# EAGLE design FDL-2X CTRL (EAGLE 8.3.2)
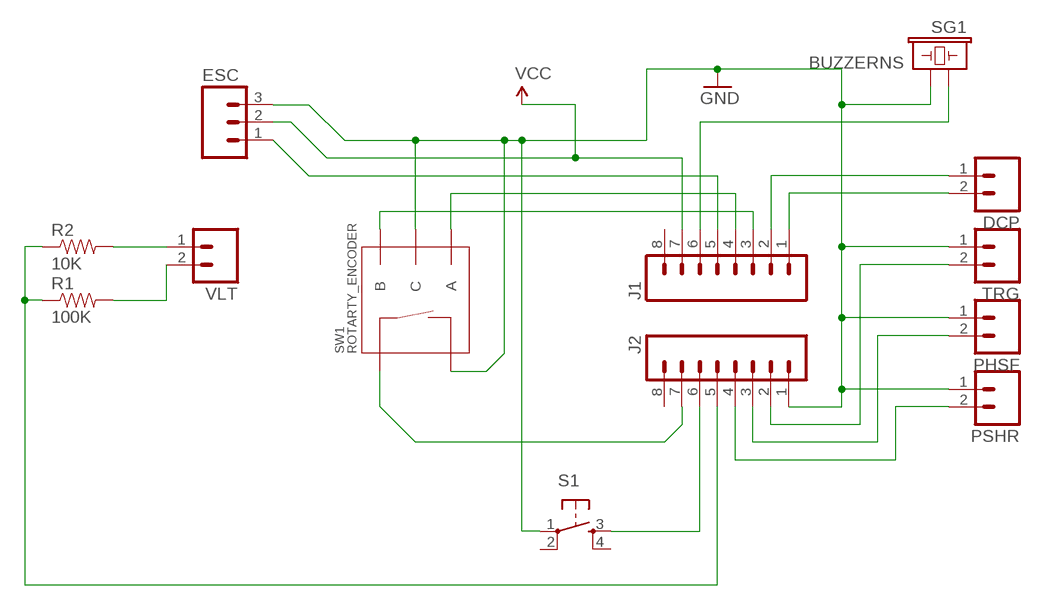
[diagram p0: schematic, sheet 1]

## Parts
DCP  M02PTH  [1X02]
ESC  M03PTH  [1X03]
J1  M08SILK_FEMALE_PTH  [1X08]
J2  M08SILK_FEMALE_PTH  [1X08]
PHSF  M02PTH  [1X02]
PSHR  M02PTH  [1X02]
R1  100K  RESISTORAXIAL-0.3  [AXIAL-0.3]
R2  10K  RESISTORAXIAL-0.3  [AXIAL-0.3]
S1  TAC_SWITCHPTH  [TACTILE-PTH]
SG1  BUZZERNS  [BUZZER-12MM-NS]
SW1  ROTARTY_ENCODER  [ROTARY_ENC_PLAIN]
TRG  M02PTH  [1X02]
VLT  M02PTH  [1X02]

## Nets
GND: ESC.3 J2.1 PHSF.1 PSHR.1 S1.1 SG1.- SW1.C SW1.SW- TRG.1
N$1: ESC.1 J1.5
N$2: J2.6 S1.3
N$3: J2.2 TRG.2
N$4: J2.3 PHSF.2
N$6: J2.7 SW1.SW+
N$7: J2.4 PSHR.2
N$8: J1.4 SW1.A
N$9: J1.3 SW1.B
N$10: DCP.1 J1.2
N$11: R2.P$2 VLT.1
N$12: DCP.2 J1.1
N$13: R1.P$2 VLT.2
N$14: J1.6 SG1.+
N$18: J2.5 R1.P$1 R2.P$1
VCC: ESC.2 J1.7
Unconnected: J1.8 J2.8 S1.2 S1.4

## Library data of the parts
DCP PHSF PSHR TRG VLT = SparkFun-Connectors:M02: Standard 2-pin 0.1" header. Use with - straight break away headers ( PRT-00116) - right angle break away headers (PRT-00553) - swiss pins (PRT-00743) - machine pins (PRT-00117) - female headers (PRT-00115) Molex polarized connector foot print use with: PRT-08233 with associated crimp pins and housings. 2.54_SCREWTERM for use with PRT-10571. 3.5mm Screw Terminal footprints for PRT-08084 5mm Screw Terminal footprints for use with PRT-08432
ESC = SparkFun-Connectors:M03: Header 3 Standard 3-pin 0.1" header. Use with straight break away headers (SKU : PRT-00116), right angle break away headers (PRT-00553), swiss pins (PRT-00743), machine pins (PRT-00117), and female headers (PRT-00115). Molex polarized connector foot print use with SKU : PRT-08232 with associated crimp pins and housings.
J1 J2 = SparkFun-Connectors:M08: Header 8 Standard 8-pin 0.1" header. Use with straight break away headers (SKU : PRT-00116), right angle break away headers (PRT-00553), swiss pins (PRT-00743), machine pins (PRT-00117), and female headers (PRT-00115).; PROD_ID: CONN-08438
R1 R2 = SparkFun-Passives:RESISTOR: Resistor Basic schematic elements and footprints for 0603, 1206, and PTH resistors.
S1 = SparkFun-Retired:TAC_SWITCH: Momentary Switch Button commonly used for reset or general input. Spark Fun Electronics SKU : COM-00097 SMT- SWCH-08247
SG1 = SparkFun-Electromechanical:BUZZER: Buzzer 12mm Spark Fun Electronics SKU : Comp-Buzzer
SW1 = Encoder:ROTARTY_ENCODER: Simple no LED rotary encoder Example: COM-09117

## Board
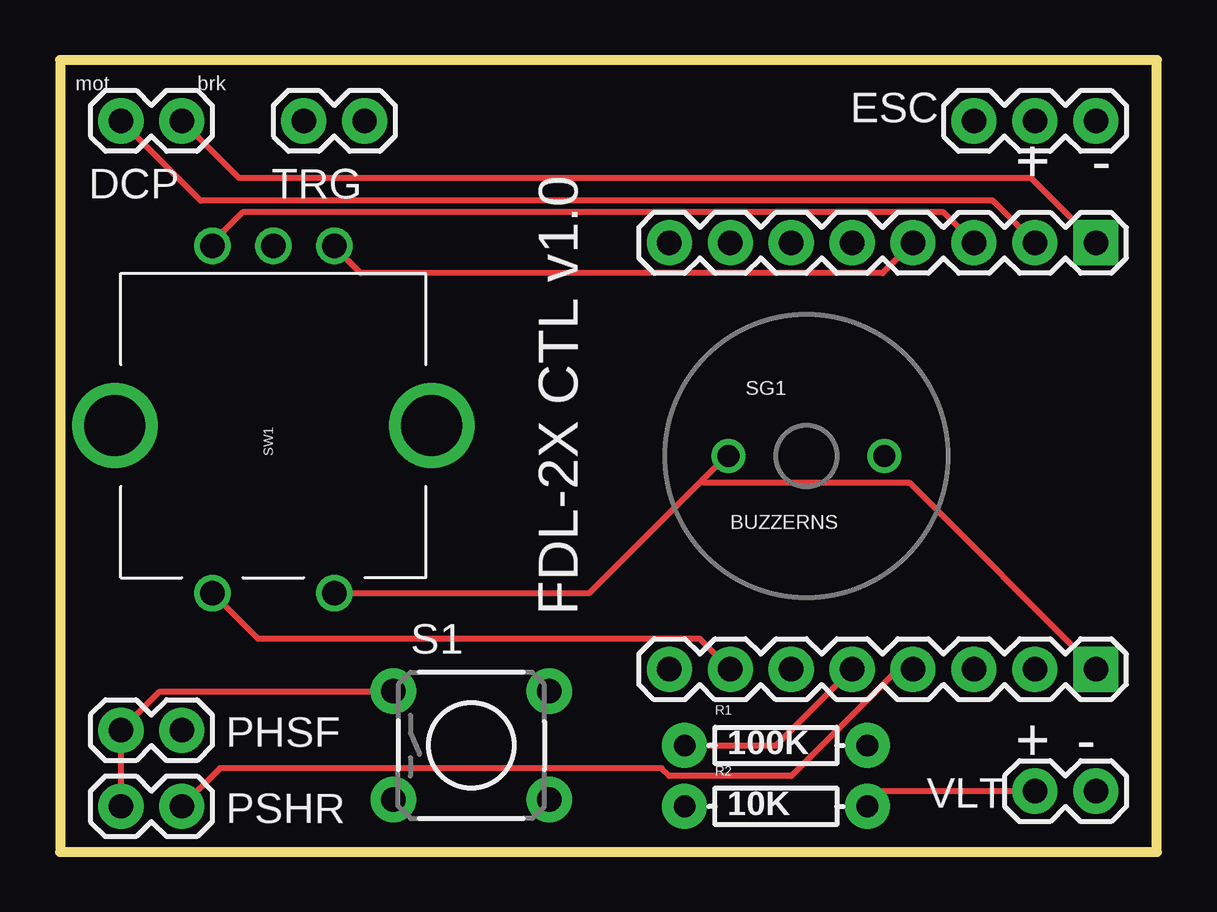
[diagram p1: board, top side]
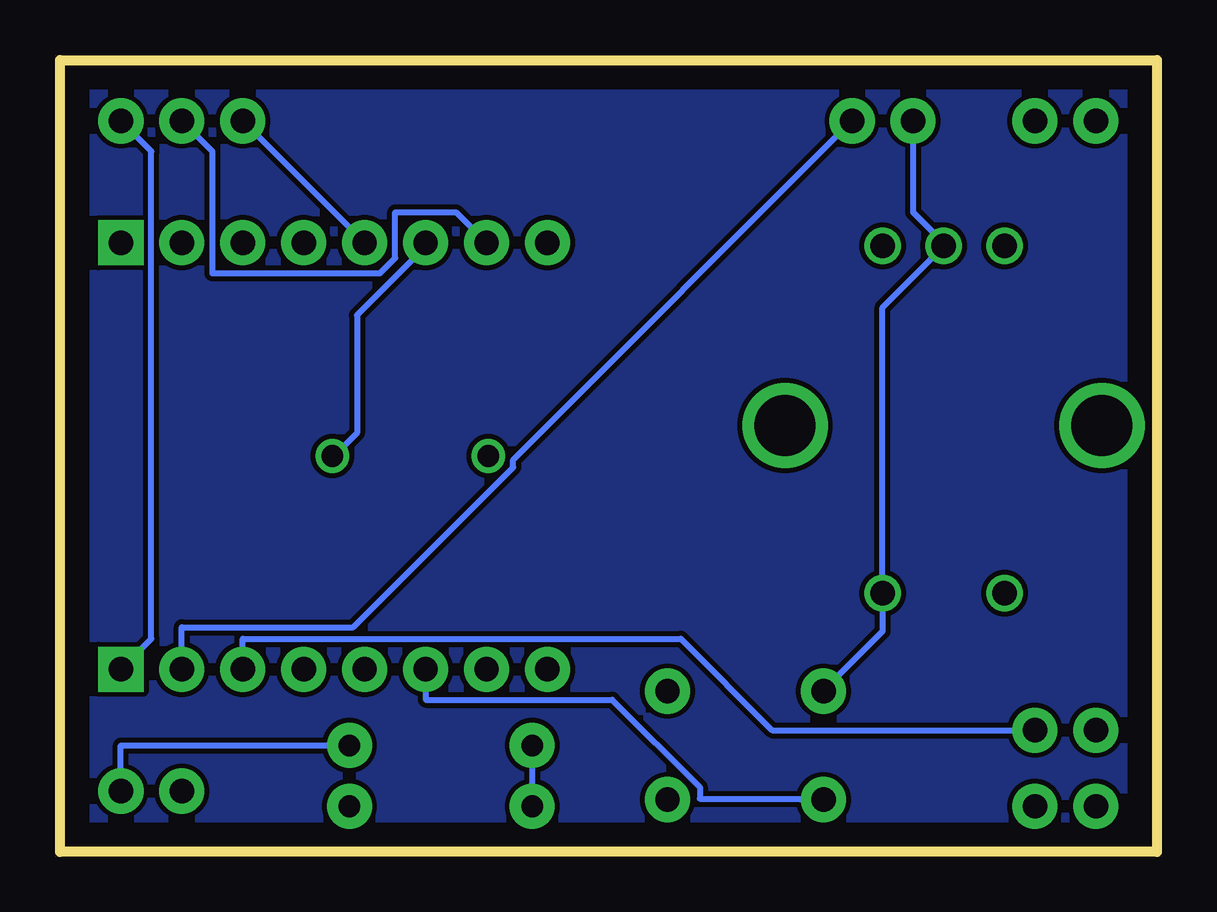
[diagram p2: board, bottom side, seen from below]

Size 45.72 x 33.02 mm. Coordinates in mm from the lower left corner, seen from the top.
Outline: 0,0 45.72,0 45.72,33.02 0,33.02 0,0
Copper layers (1*16): Top 0.035mm / dielectric 1.5mm / Bottom 0.035mm
Design rules "default": minimum track width 10mil, minimum drill 24mil, track to track 8mil, track to pad 8mil, pad to pad 8mil, via to via 8mil, smd to smd 8mil, copper to edge 40mil, drill to drill 8mil, minimum pad ring 10mil, minimum via ring 8mil, stop-mask expansion 4mil, vias tented up to drill 0mil, thermal gap 10mil

### Footprints (pad centres in the part's own frame; a part is rotated, then mirrored left to right if it is on the bottom)
1X02 = drill 1.016 pad 1.88: 1 0,0; 2 2.54,0
1X03 = drill 1.016 pad 1.88: 1 0,0; 2 2.54,0; 3 5.08,0
1X08 = drill 1.016 pad 1.88 square: 1 0,0 | drill 1.016 pad 1.88: 2 2.54,0; 3 5.08,0; 4 7.62,0; 5 10.16,0; 6 12.7,0; 7 15.24,0; 8 17.78,0
AXIAL-0.3 = drill 0.9 pad 1.88: P$1 -3.81,0; P$2 3.81,0
TACTILE-PTH = drill 1.016 pad 1.88: 1 -3.251,2.261; 2 3.251,2.261; 3 -3.251,-2.261; 4 3.251,-2.261
BUZZER-12MM-NS = drill 0.9: + 3.25,0; - -3.25,0
ROTARY_ENC_PLAIN = drill 1.016: A 7.493,-2.54; B 7.493,2.54; C 7.493,0; SW+ -6.985,2.54; SW- -6.985,-2.54 | drill 2.54: P$3 0,6.604; P$4 0,-6.604

### Placement (x,y rotation side)
DCP  2.54,30.48 0 top
ESC  38.1,30.48 0 top
J1  43.18,25.4 180 top
J2  43.18,7.62 180 top
PHSF  2.54,5.08 0 top
PSHR  2.54,1.91 0 top
R1  29.84,4.45 0 top
R2  29.84,1.91 0 top
S1  17.14,4.45 0 top
SG1  31.11,16.51 0 top
SW1  8.89,17.78 90 top
TRG  10.16,30.48 0 top
VLT  40.64,2.54 0 top

### Tracks (layer width: path | path; a pad name or v marks a point on that pad's centre or on a via)
GND
  Top 0.254: PSHR.1 PHSF.1 4.13,6.67 13.81,6.67 S1.1 | 26.75,15.48 22.07,10.79 SW1.SW- | 26.75,15.48 27.78,16.51 SG1.- | J2.1 35.4,15.4 26.83,15.4 26.75,15.48
  Bottom 0.254: TRG.1 10.16,26.67 8.89,25.4 SW1.C 8.89,25.24 11.43,22.7 SW1.SW- 11.43,9.21 13.81,6.83 S1.1 | ESC.3 41.91,29.21 41.91,8.89 J2.1
N$1
  Bottom 0.254: ESC.1 J1.5
N$2
  Bottom 0.254: J2.6 30.48,6.35 22.7,6.35 19.05,2.7 19.05,2.22 13.97,2.22 S1.3
N$3
  Bottom 0.254: TRG.2 26.83,16.35 26.83,16.03 33.5,9.37 40.64,9.37 J2.2
N$4
  Bottom 0.254: PHSF.2 16.03,5.08 19.84,8.89 38.1,8.89 J2.3
N$5
  pour Bottom: 0,0 45.72,0 45.72,33.02 0,33.02
N$6
  Top 0.254: SW1.SW+ 8.26,8.89 26.67,8.89 J2.7
N$7
  Top 0.254: PSHR.2 6.67,3.49 25.08,3.49 25.4,3.17 30.48,3.17 34.92,7.62 J2.4
N$8
  Top 0.254: J1.4 34.29,24.13 12.54,24.13 11.43,25.24 SW1.A
N$9
  Top 0.254: J1.3 36.83,26.67 7.62,26.67 6.35,25.4 SW1.B
N$10
  Top 0.254: DCP.1 5.87,27.15 38.89,27.15 J1.2
N$11
  Top 0.254: R2.P$2 34.29,2.54 VLT.1
N$12
  Top 0.254: DCP.2 7.46,28.1 40.48,28.1 J1.1
N$13
  Bottom 0.254: R1.P$2 43.18,4.45 VLT.2
N$14
  Bottom 0.254: J1.6 30.48,25.24 33.34,22.38 33.34,17.46 34.29,16.51 SG1.+
N$18
  Top 0.254: J2.5 29.84,4.45 R1.P$1
  Bottom 0.254: R1.P$1 R2.P$1
VCC
  Bottom 0.254: J1.7 29.21,26.67 31.75,26.67 31.75,24.77 32.38,24.13 39.37,24.13 39.37,29.21 ESC.2

### Text on the board
tNames: mot | brk | + | + | - | FDL-2X CTL v1.0 | + | -